# Altium project Convertor.PrjPCB
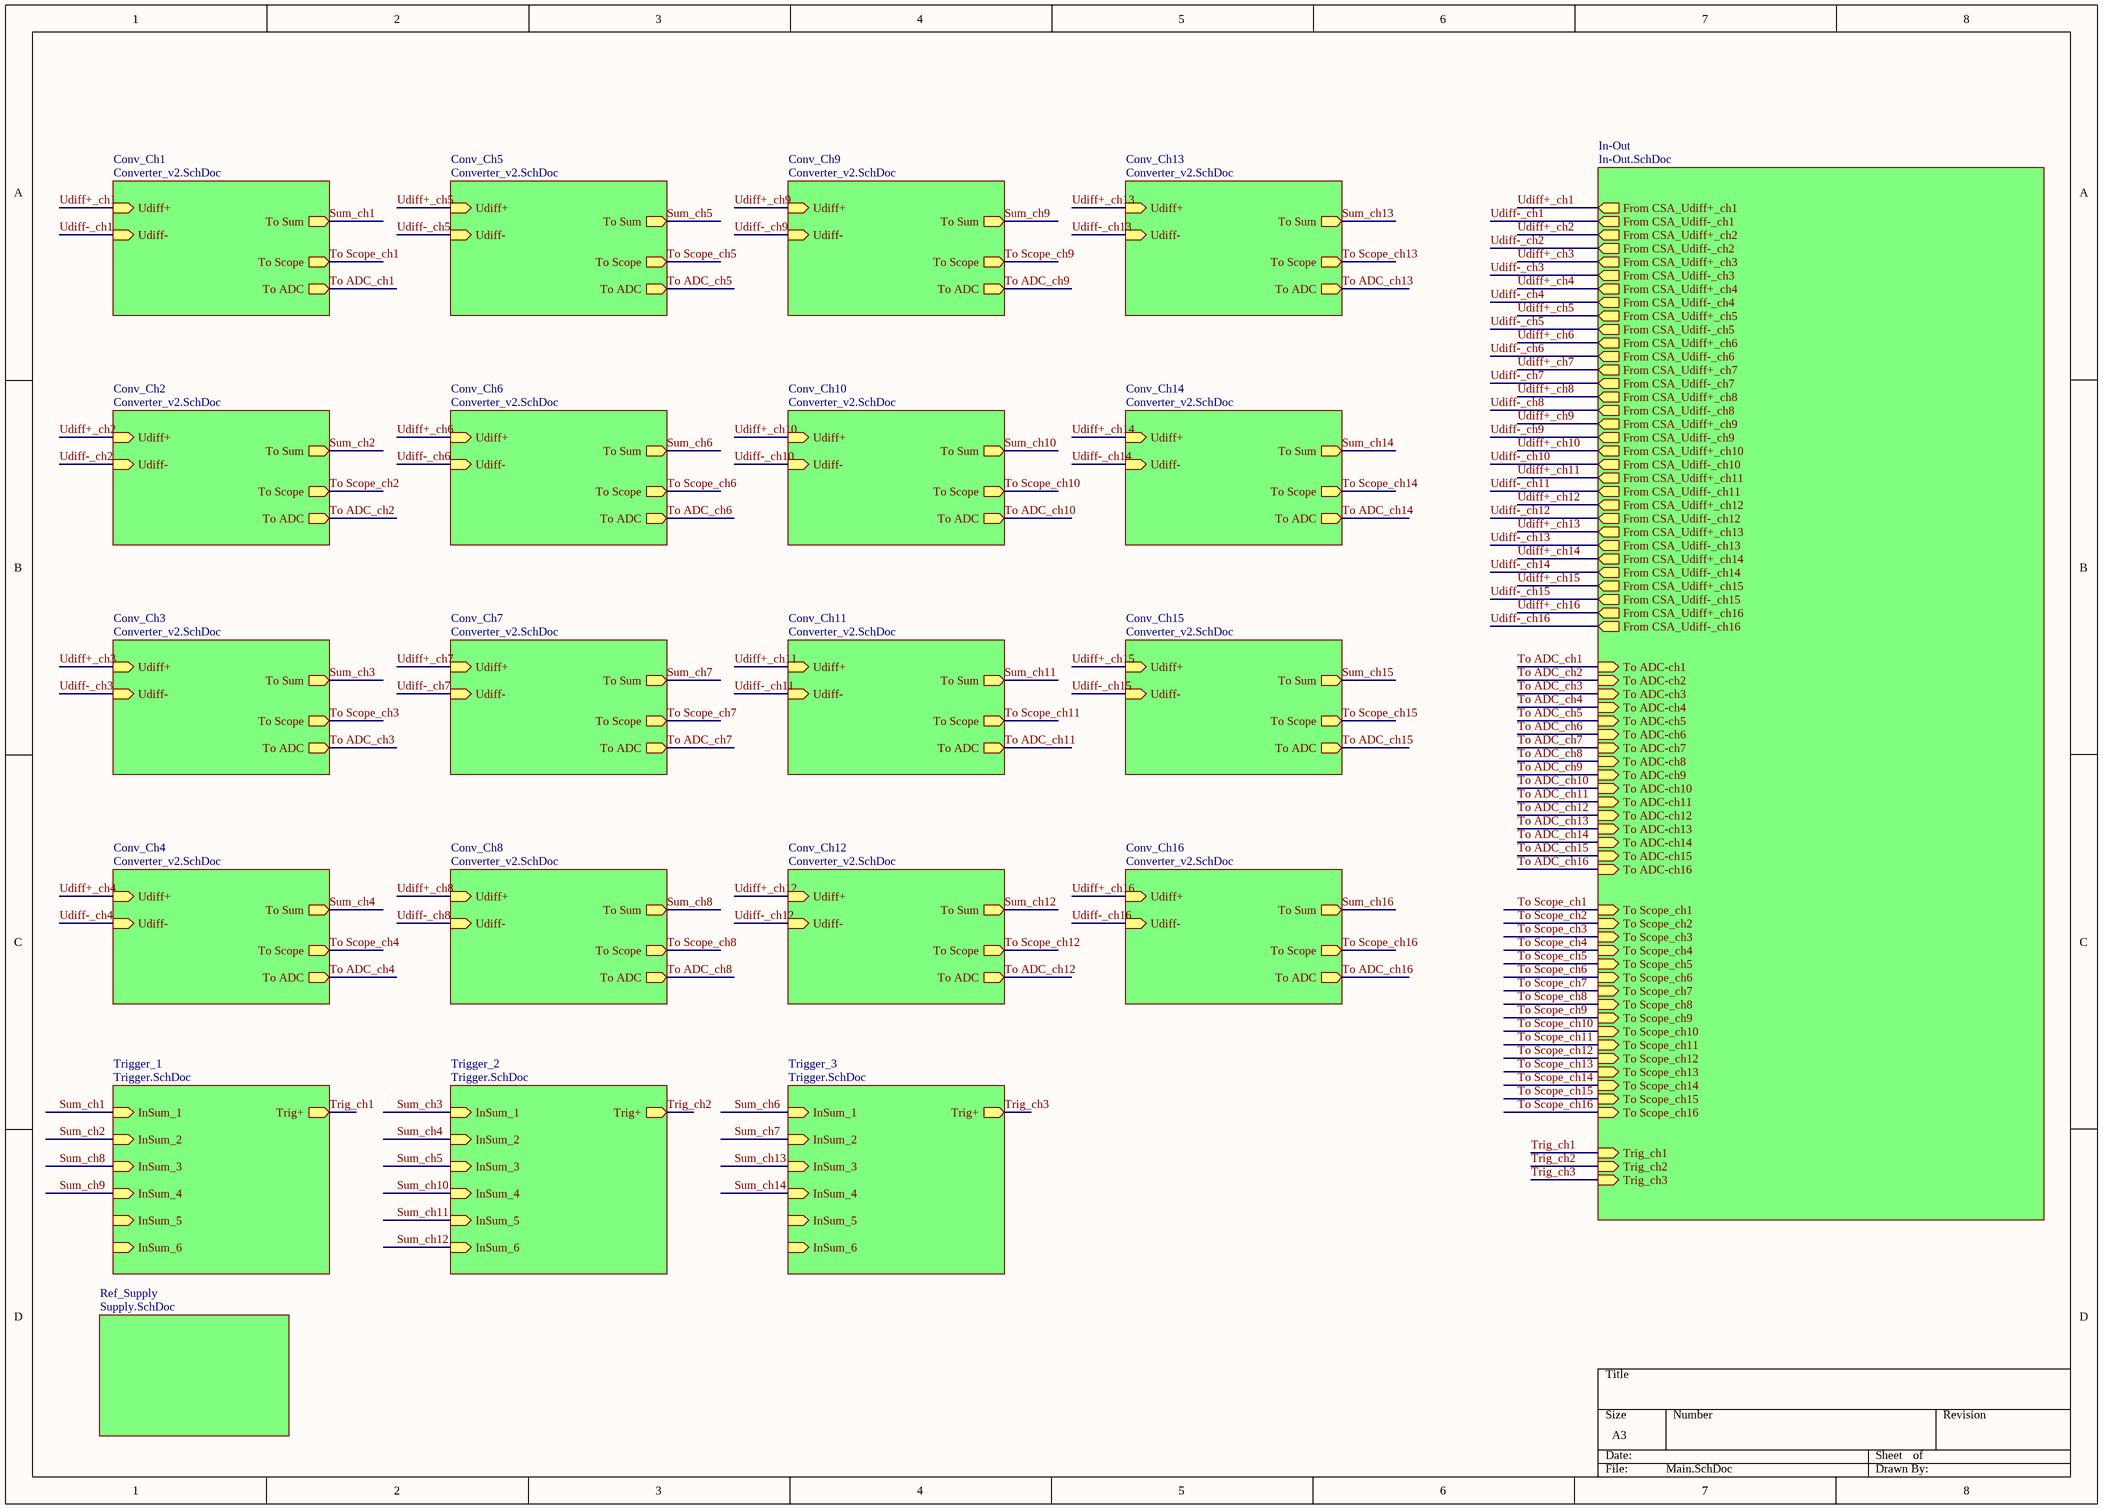
[diagram p0: Main.SchDoc]
4 sheets, 55 parts. Net scope: hierarchical (ports join the sheet entries above them; power ports are global).
Sheets:
  Main.SchDoc
    In-Out = In-Out.SchDoc
    Ref_Supply = Supply.SchDoc
    Trigger_1 = Trigger.SchDoc
    Trigger_2 = Trigger.SchDoc
    Trigger_3 = Trigger.SchDoc

## Sheet Main.SchDoc
size A3; PageSetup: Record=PageOptions|CenterHorizontal=True|CenterVertical=True|PrintScale=0.73|XCorrection=1.00|YCorrection=1.00|PrintKind=0|BorderSize=5000000|LeftOffset=0|BottomOffset=0|Orientation=2|PaperLength=1000|PaperWidth=1000|Scale=100|PaperSource=7|PrintQuality=600|MediaType=1|DitherType=10|PaperKind=A4|PrintScaleMode=1

### Sub-sheets
Conv_Ch1 = Converter_v2.SchDoc (file not in this document): Udiff+ (in), Udiff- (in), To ADC (out), To Sum (out), To Scope (out)
Conv_Ch2 = Converter_v2.SchDoc (file not in this document): Udiff+ (in), Udiff- (in), To ADC (out), To Sum (out), To Scope (out)
Conv_Ch3 = Converter_v2.SchDoc (file not in this document): Udiff+ (in), Udiff- (in), To ADC (out), To Sum (out), To Scope (out)
Conv_Ch4 = Converter_v2.SchDoc (file not in this document): Udiff+ (in), Udiff- (in), To ADC (out), To Sum (out), To Scope (out)
Conv_Ch5 = Converter_v2.SchDoc (file not in this document): Udiff+ (in), Udiff- (in), To ADC (out), To Sum (out), To Scope (out)
Conv_Ch6 = Converter_v2.SchDoc (file not in this document): Udiff+ (in), Udiff- (in), To ADC (out), To Sum (out), To Scope (out)
Conv_Ch7 = Converter_v2.SchDoc (file not in this document): Udiff+ (in), Udiff- (in), To ADC (out), To Sum (out), To Scope (out)
Conv_Ch8 = Converter_v2.SchDoc (file not in this document): Udiff+ (in), Udiff- (in), To ADC (out), To Sum (out), To Scope (out)
Conv_Ch9 = Converter_v2.SchDoc (file not in this document): Udiff+ (in), Udiff- (in), To ADC (out), To Sum (out), To Scope (out)
Conv_Ch10 = Converter_v2.SchDoc (file not in this document): Udiff+ (in), Udiff- (in), To ADC (out), To Sum (out), To Scope (out)
Conv_Ch11 = Converter_v2.SchDoc (file not in this document): Udiff+ (in), Udiff- (in), To ADC (out), To Sum (out), To Scope (out)
Conv_Ch12 = Converter_v2.SchDoc (file not in this document): Udiff+ (in), Udiff- (in), To ADC (out), To Sum (out), To Scope (out)
Conv_Ch13 = Converter_v2.SchDoc (file not in this document): Udiff+ (in), Udiff- (in), To ADC (out), To Sum (out), To Scope (out)
Conv_Ch14 = Converter_v2.SchDoc (file not in this document): Udiff+ (in), Udiff- (in), To ADC (out), To Sum (out), To Scope (out)
Conv_Ch15 = Converter_v2.SchDoc (file not in this document): Udiff+ (in), Udiff- (in), To ADC (out), To Sum (out), To Scope (out)
Conv_Ch16 = Converter_v2.SchDoc (file not in this document): Udiff+ (in), Udiff- (in), To ADC (out), To Sum (out), To Scope (out)
In-Out = In-Out.SchDoc: To ADC-ch1 (in), To ADC-ch2 (in), To ADC-ch3 (in), To ADC-ch4 (in), To ADC-ch5 (in), To ADC-ch6 (in), To ADC-ch7 (in), To ADC-ch8 (in), To ADC-ch9 (in), To ADC-ch10 (in), To ADC-ch11 (in), To ADC-ch12 (in), To ADC-ch13 (in), To ADC-ch14 (in), From CSA_Udiff+_ch1 (out), From CSA_Udiff+_ch2 (out), From CSA_Udiff+_ch3 (out), From CSA_Udiff+_ch4 (out), From CSA_Udiff+_ch5 (out), From CSA_Udiff+_ch6 (out), From CSA_Udiff+_ch7 (out), From CSA_Udiff+_ch8 (out), From CSA_Udiff+_ch9 (out), From CSA_Udiff+_ch10 (out), From CSA_Udiff+_ch11 (out), From CSA_Udiff+_ch12 (out), From CSA_Udiff+_ch13 (out), From CSA_Udiff+_ch14 (out), From CSA_Udiff-_ch1 (out), From CSA_Udiff-_ch2 (out), From CSA_Udiff-_ch3 (out), From CSA_Udiff-_ch4 (out), From CSA_Udiff-_ch5 (out), From CSA_Udiff-_ch6 (out), From CSA_Udiff-_ch7 (out), From CSA_Udiff-_ch8 (out), From CSA_Udiff-_ch9 (out), From CSA_Udiff-_ch10 (out), From CSA_Udiff-_ch11 (out), From CSA_Udiff-_ch12 (out), From CSA_Udiff-_ch13 (out), From CSA_Udiff-_ch14 (out), To ADC-ch15 (in), To ADC-ch16 (in), From CSA_Udiff+_ch15 (out), From CSA_Udiff+_ch16 (out), From CSA_Udiff-_ch15 (out), From CSA_Udiff-_ch16 (out), Trig_ch1 (in), Trig_ch2 (in), Trig_ch3 (in), To Scope_ch1 (in), To Scope_ch2 (in), To Scope_ch3 (in), To Scope_ch4 (in), To Scope_ch5 (in), To Scope_ch6 (in), To Scope_ch7 (in), To Scope_ch8 (in), To Scope_ch9 (in), To Scope_ch10 (in), To Scope_ch11 (in), To Scope_ch12 (in), To Scope_ch13 (in), To Scope_ch14 (in), To Scope_ch15 (in), To Scope_ch16 (in)
Ref_Supply = Supply.SchDoc: no entries
Trigger_1 = Trigger.SchDoc: InSum_1 (in), InSum_2 (in), InSum_3 (in), InSum_4 (in), Trig+ (out), InSum_5 (in), InSum_6 (in)
Trigger_2 = Trigger.SchDoc: InSum_1 (in), InSum_2 (in), InSum_3 (in), InSum_4 (in), Trig+ (out), InSum_5 (in), InSum_6 (in)
Trigger_3 = Trigger.SchDoc: InSum_1 (in), InSum_2 (in), InSum_3 (in), InSum_4 (in), Trig+ (out), InSum_5 (in), InSum_6 (in)

### Nets
Sum_ch1: sheet Conv_Ch1/To Sum, sheet Conv_Ch2/To Sum, sheet Conv_Ch8/To Sum, sheet Conv_Ch9/To Sum, sheet Trigger_1/InSum_1, sheet Trigger_1/InSum_2, sheet Trigger_1/InSum_3, sheet Trigger_1/InSum_4, sheet Trigger_1/InSum_5, sheet Trigger_1/InSum_6  [also labelled Sum_ch2, Sum_ch8, Sum_ch9]
Sum_ch10: sheet Conv_Ch3/To Sum, sheet Conv_Ch4/To Sum, sheet Conv_Ch5/To Sum, sheet Conv_Ch10/To Sum, sheet Conv_Ch11/To Sum, sheet Conv_Ch12/To Sum, sheet Trigger_2/InSum_1, sheet Trigger_2/InSum_2, sheet Trigger_2/InSum_3, sheet Trigger_2/InSum_4, sheet Trigger_2/InSum_5, sheet Trigger_2/InSum_6  [also labelled Sum_ch11, Sum_ch12, Sum_ch3, Sum_ch4, Sum_ch5]
Sum_ch13: sheet Conv_Ch6/To Sum, sheet Conv_Ch7/To Sum, sheet Conv_Ch13/To Sum, sheet Conv_Ch14/To Sum, sheet Trigger_3/InSum_1, sheet Trigger_3/InSum_2, sheet Trigger_3/InSum_3, sheet Trigger_3/InSum_4, sheet Trigger_3/InSum_5, sheet Trigger_3/InSum_6  [also labelled Sum_ch14, Sum_ch6, Sum_ch7]
Sum_ch15: sheet Conv_Ch15/To Sum
Sum_ch16: sheet Conv_Ch16/To Sum
To ADC_ch1: sheet Conv_Ch1/To ADC, sheet In-Out/To ADC-ch1
To ADC_ch2: sheet Conv_Ch2/To ADC, sheet In-Out/To ADC-ch2
To ADC_ch3: sheet Conv_Ch3/To ADC, sheet In-Out/To ADC-ch3
To ADC_ch4: sheet Conv_Ch4/To ADC, sheet In-Out/To ADC-ch4
To ADC_ch5: sheet Conv_Ch5/To ADC, sheet In-Out/To ADC-ch5
To ADC_ch6: sheet Conv_Ch6/To ADC, sheet In-Out/To ADC-ch6
To ADC_ch7: sheet Conv_Ch7/To ADC, sheet In-Out/To ADC-ch7
To ADC_ch8: sheet Conv_Ch8/To ADC, sheet In-Out/To ADC-ch8
To ADC_ch9: sheet Conv_Ch9/To ADC, sheet In-Out/To ADC-ch9
To ADC_ch10: sheet Conv_Ch10/To ADC, sheet In-Out/To ADC-ch10
To ADC_ch11: sheet Conv_Ch11/To ADC, sheet In-Out/To ADC-ch11
To ADC_ch12: sheet Conv_Ch12/To ADC, sheet In-Out/To ADC-ch12
To ADC_ch13: sheet Conv_Ch13/To ADC, sheet In-Out/To ADC-ch13
To ADC_ch14: sheet Conv_Ch14/To ADC, sheet In-Out/To ADC-ch14
To ADC_ch15: sheet Conv_Ch15/To ADC, sheet In-Out/To ADC-ch15
To ADC_ch16: sheet Conv_Ch16/To ADC, sheet In-Out/To ADC-ch16
To Scope_ch1: sheet Conv_Ch1/To Scope, sheet In-Out/To Scope_ch1
To Scope_ch2: sheet Conv_Ch2/To Scope, sheet In-Out/To Scope_ch2
To Scope_ch3: sheet Conv_Ch3/To Scope, sheet In-Out/To Scope_ch3
To Scope_ch4: sheet Conv_Ch4/To Scope, sheet In-Out/To Scope_ch4
To Scope_ch5: sheet Conv_Ch5/To Scope, sheet In-Out/To Scope_ch5
To Scope_ch6: sheet Conv_Ch6/To Scope, sheet In-Out/To Scope_ch6
To Scope_ch7: sheet Conv_Ch7/To Scope, sheet In-Out/To Scope_ch7
To Scope_ch8: sheet Conv_Ch8/To Scope, sheet In-Out/To Scope_ch8
To Scope_ch9: sheet Conv_Ch9/To Scope, sheet In-Out/To Scope_ch9
To Scope_ch10: sheet Conv_Ch10/To Scope, sheet In-Out/To Scope_ch10
To Scope_ch11: sheet Conv_Ch11/To Scope, sheet In-Out/To Scope_ch11
To Scope_ch12: sheet Conv_Ch12/To Scope, sheet In-Out/To Scope_ch12
To Scope_ch13: sheet Conv_Ch13/To Scope, sheet In-Out/To Scope_ch13
To Scope_ch14: sheet Conv_Ch14/To Scope, sheet In-Out/To Scope_ch14
To Scope_ch15: sheet Conv_Ch15/To Scope, sheet In-Out/To Scope_ch15
To Scope_ch16: sheet Conv_Ch16/To Scope, sheet In-Out/To Scope_ch16
Trig_ch1: sheet In-Out/Trig_ch1, sheet Trigger_1/Trig+
Trig_ch2: sheet In-Out/Trig_ch2, sheet Trigger_2/Trig+
Trig_ch3: sheet In-Out/Trig_ch3, sheet Trigger_3/Trig+
Udiff+_ch1: sheet Conv_Ch1/Udiff+, sheet In-Out/From CSA_Udiff+_ch1
Udiff+_ch2: sheet Conv_Ch2/Udiff+, sheet In-Out/From CSA_Udiff+_ch2
Udiff+_ch3: sheet Conv_Ch3/Udiff+, sheet In-Out/From CSA_Udiff+_ch3
Udiff+_ch4: sheet Conv_Ch4/Udiff+, sheet In-Out/From CSA_Udiff+_ch4
Udiff+_ch5: sheet Conv_Ch5/Udiff+, sheet In-Out/From CSA_Udiff+_ch5
Udiff+_ch6: sheet Conv_Ch6/Udiff+, sheet In-Out/From CSA_Udiff+_ch6
Udiff+_ch7: sheet Conv_Ch7/Udiff+, sheet In-Out/From CSA_Udiff+_ch7
Udiff+_ch8: sheet Conv_Ch8/Udiff+, sheet In-Out/From CSA_Udiff+_ch8
Udiff+_ch9: sheet Conv_Ch9/Udiff+, sheet In-Out/From CSA_Udiff+_ch9
Udiff+_ch10: sheet Conv_Ch10/Udiff+, sheet In-Out/From CSA_Udiff+_ch10
Udiff+_ch11: sheet Conv_Ch11/Udiff+, sheet In-Out/From CSA_Udiff+_ch11
Udiff+_ch12: sheet Conv_Ch12/Udiff+, sheet In-Out/From CSA_Udiff+_ch12
Udiff+_ch13: sheet Conv_Ch13/Udiff+, sheet In-Out/From CSA_Udiff+_ch13
Udiff+_ch14: sheet Conv_Ch14/Udiff+, sheet In-Out/From CSA_Udiff+_ch14
Udiff+_ch15: sheet Conv_Ch15/Udiff+, sheet In-Out/From CSA_Udiff+_ch15
Udiff+_ch16: sheet Conv_Ch16/Udiff+, sheet In-Out/From CSA_Udiff+_ch16
Udiff-_ch1: sheet Conv_Ch1/Udiff-, sheet In-Out/From CSA_Udiff-_ch1
Udiff-_ch2: sheet Conv_Ch2/Udiff-, sheet In-Out/From CSA_Udiff-_ch2
Udiff-_ch3: sheet Conv_Ch3/Udiff-, sheet In-Out/From CSA_Udiff-_ch3
Udiff-_ch4: sheet Conv_Ch4/Udiff-, sheet In-Out/From CSA_Udiff-_ch4
Udiff-_ch5: sheet Conv_Ch5/Udiff-, sheet In-Out/From CSA_Udiff-_ch5
Udiff-_ch6: sheet Conv_Ch6/Udiff-, sheet In-Out/From CSA_Udiff-_ch6
Udiff-_ch7: sheet Conv_Ch7/Udiff-, sheet In-Out/From CSA_Udiff-_ch7
Udiff-_ch8: sheet Conv_Ch8/Udiff-, sheet In-Out/From CSA_Udiff-_ch8
Udiff-_ch9: sheet Conv_Ch9/Udiff-, sheet In-Out/From CSA_Udiff-_ch9
Udiff-_ch10: sheet Conv_Ch10/Udiff-, sheet In-Out/From CSA_Udiff-_ch10
Udiff-_ch11: sheet Conv_Ch11/Udiff-, sheet In-Out/From CSA_Udiff-_ch11
Udiff-_ch12: sheet Conv_Ch12/Udiff-, sheet In-Out/From CSA_Udiff-_ch12
Udiff-_ch13: sheet Conv_Ch13/Udiff-, sheet In-Out/From CSA_Udiff-_ch13
Udiff-_ch14: sheet Conv_Ch14/Udiff-, sheet In-Out/From CSA_Udiff-_ch14
Udiff-_ch15: sheet Conv_Ch15/Udiff-, sheet In-Out/From CSA_Udiff-_ch15
Udiff-_ch16: sheet Conv_Ch16/Udiff-, sheet In-Out/From CSA_Udiff-_ch16

## Sheet In-Out.SchDoc
size A4; PageSetup: Record=PageOptions|CenterHorizontal=True|CenterVertical=True|PrintScale=1.00|XCorrection=1.00|YCorrection=1.00|PrintKind=0|BorderSize=5000000|LeftOffset=0|BottomOffset=0|Orientation=2|PaperLength=1000|PaperWidth=1000|Scale=100|PaperSource=7|PrintQuality=-4|MediaType=1|DitherType=10|PaperKind=A4|PrintScaleMode=1
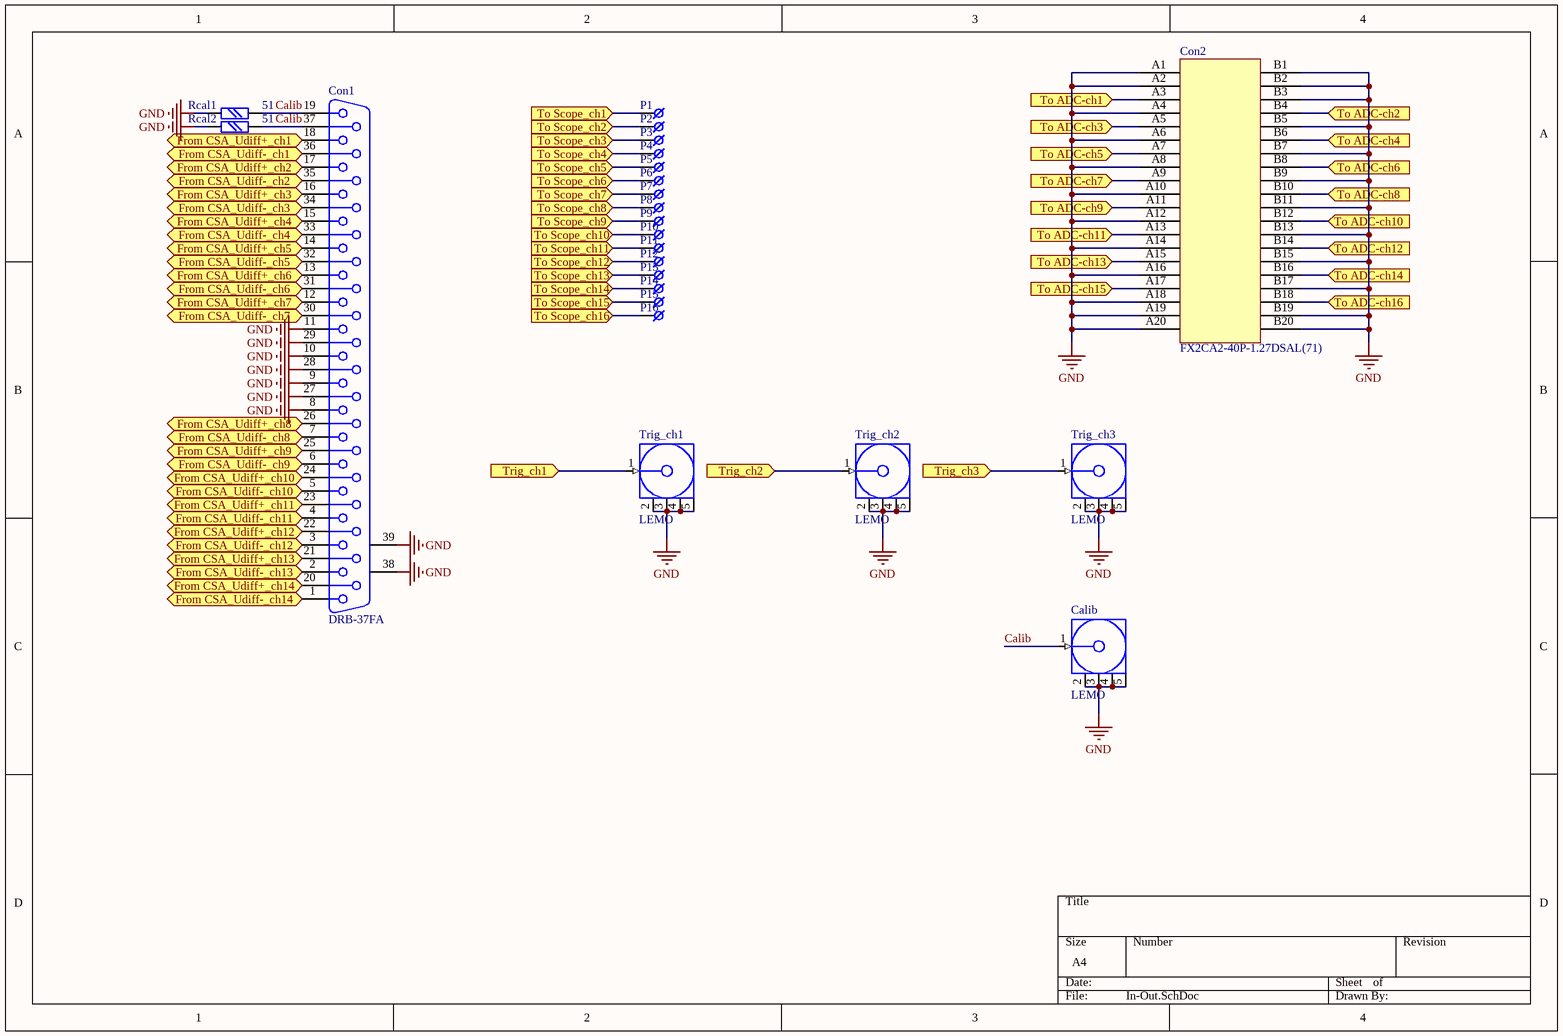
[diagram p1: In-Out.SchDoc]

### Parts
Calib  LEMO  [LEMO]
Con1  DRB-37FA  [DBR-F-37]
Con2  FX2CA2-40P-1.27DSAL(71)
P1  KLEMME  [Pad12]  (value not drawn)
P2  KLEMME  [Pad12]  (value not drawn)
P3  KLEMME  [Pad12]  (value not drawn)
P4  KLEMME  [Pad12]  (value not drawn)
P5  KLEMME  [Pad12]  (value not drawn)
P6  KLEMME  [Pad12]  (value not drawn)
P7  KLEMME  [Pad12]  (value not drawn)
P8  KLEMME  [Pad12]  (value not drawn)
P9  KLEMME  [Pad12]  (value not drawn)
P10  KLEMME  [Pad12]  (value not drawn)
P11  KLEMME  [Pad12]  (value not drawn)
P12  KLEMME  [Pad12]  (value not drawn)
P13  KLEMME  [Pad12]  (value not drawn)
P14  KLEMME  [Pad12]  (value not drawn)
P15  KLEMME  [Pad12]  (value not drawn)
P16  KLEMME  [Pad12]  (value not drawn)
Rcal1  51  [chip0603]
Rcal2  51  [chip0603]
Trig_ch1  LEMO  [LEMO]
Trig_ch2  LEMO  [LEMO]
Trig_ch3  LEMO  [LEMO]

### Ports
From CSA_Udiff+_ch1 (in), From CSA_Udiff+_ch2 (in), From CSA_Udiff+_ch3 (in), From CSA_Udiff+_ch4 (in), From CSA_Udiff+_ch5 (in), From CSA_Udiff+_ch6 (in), From CSA_Udiff+_ch7 (in), From CSA_Udiff+_ch8 (in), From CSA_Udiff+_ch9 (in), From CSA_Udiff+_ch10 (in), From CSA_Udiff+_ch11 (in), From CSA_Udiff+_ch12 (in), From CSA_Udiff+_ch13 (in), From CSA_Udiff+_ch14 (in), From CSA_Udiff-_ch1 (in), From CSA_Udiff-_ch2 (in), From CSA_Udiff-_ch3 (in), From CSA_Udiff-_ch4 (in), From CSA_Udiff-_ch5 (in), From CSA_Udiff-_ch6 (in), From CSA_Udiff-_ch7 (in), From CSA_Udiff-_ch8 (in), From CSA_Udiff-_ch9 (in), From CSA_Udiff-_ch10 (in), From CSA_Udiff-_ch11 (in), From CSA_Udiff-_ch12 (in), From CSA_Udiff-_ch13 (in), From CSA_Udiff-_ch14 (in), To ADC-ch1 (in), To ADC-ch2 (in), To ADC-ch3 (in), To ADC-ch4 (in), To ADC-ch5 (in), To ADC-ch6 (in), To ADC-ch7 (in), To ADC-ch8 (in), To ADC-ch9 (in), To ADC-ch10 (in), To ADC-ch11 (in), To ADC-ch12 (in), To ADC-ch13 (in), To ADC-ch14 (in), To ADC-ch15 (in), To ADC-ch16 (in), To Scope_ch1 (in), To Scope_ch2 (in), To Scope_ch3 (in), To Scope_ch4 (in), To Scope_ch5 (in), To Scope_ch6 (in), To Scope_ch7 (in), To Scope_ch8 (in), To Scope_ch9 (in), To Scope_ch10 (in), To Scope_ch11 (in), To Scope_ch12 (in), To Scope_ch13 (in), To Scope_ch14 (in), To Scope_ch15 (in), To Scope_ch16 (in), Trig_ch1 (in), Trig_ch2 (in), Trig_ch3 (in)

### Nets
GND: Calib.2(GND) Calib.3(GND) Calib.4(GND) Calib.5(GND) Con1.8 Con1.9 Con1.10 Con1.11 Con1.27 Con1.28 Con1.29 Con1.38 Con1.39 Con2.A1 Con2.A2 Con2.A4 Con2.A6 Con2.A8 Con2.A10 Con2.A12 Con2.A14 Con2.A16 Con2.A18 Con2.A19 Con2.A20 Con2.B1 Con2.B2 Con2.B3 Con2.B5 Con2.B7 Con2.B9 Con2.B11 Con2.B13 Con2.B15 Con2.B17 Con2.B19 Con2.B20 Rcal1.2 Rcal2.2 Trig_ch1.2(GND) Trig_ch1.3(GND) Trig_ch1.4(GND) Trig_ch1.5(GND) Trig_ch2.2(GND) Trig_ch2.3(GND) Trig_ch2.4(GND) Trig_ch2.5(GND) Trig_ch3.2(GND) Trig_ch3.3(GND) Trig_ch3.4(GND) Trig_ch3.5(GND)
Calib: Calib.1(Signal) Con1.19 Con1.37 Rcal1.1 Rcal2.1
To ADC_ch1: Con2.A3 ; port To ADC-ch1
To ADC_ch2: Con2.B4 ; port To ADC-ch2
To ADC_ch3: Con2.A5 ; port To ADC-ch3
To ADC_ch4: Con2.B6 ; port To ADC-ch4
To ADC_ch5: Con2.A7 ; port To ADC-ch5
To ADC_ch6: Con2.B8 ; port To ADC-ch6
To ADC_ch7: Con2.A9 ; port To ADC-ch7
To ADC_ch8: Con2.B10 ; port To ADC-ch8
To ADC_ch9: Con2.A11 ; port To ADC-ch9
To ADC_ch10: Con2.B12 ; port To ADC-ch10
To ADC_ch11: Con2.A13 ; port To ADC-ch11
To ADC_ch12: Con2.B14 ; port To ADC-ch12
To ADC_ch13: Con2.A15 ; port To ADC-ch13
To ADC_ch14: Con2.B16 ; port To ADC-ch14
To ADC_ch15: Con2.A17 ; port To ADC-ch15
To ADC_ch16: Con2.B18 ; port To ADC-ch16
To Scope_ch1: P1.PAD ; port To Scope_ch1
To Scope_ch2: P2.PAD ; port To Scope_ch2
To Scope_ch3: P3.PAD ; port To Scope_ch3
To Scope_ch4: P4.PAD ; port To Scope_ch4
To Scope_ch5: P5.PAD ; port To Scope_ch5
To Scope_ch6: P6.PAD ; port To Scope_ch6
To Scope_ch7: P7.PAD ; port To Scope_ch7
To Scope_ch8: P8.PAD ; port To Scope_ch8
To Scope_ch9: P9.PAD ; port To Scope_ch9
To Scope_ch10: P10.PAD ; port To Scope_ch10
To Scope_ch11: P11.PAD ; port To Scope_ch11
To Scope_ch12: P12.PAD ; port To Scope_ch12
To Scope_ch13: P13.PAD ; port To Scope_ch13
To Scope_ch14: P14.PAD ; port To Scope_ch14
To Scope_ch15: P15.PAD ; port To Scope_ch15
To Scope_ch16: P16.PAD ; port To Scope_ch16
Trig_ch1: Trig_ch1.1(Signal) ; port Trig_ch1
Trig_ch2: Trig_ch2.1(Signal) ; port Trig_ch2
Trig_ch3: Trig_ch3.1(Signal) ; port Trig_ch3
Udiff+_ch1: Con1.18 ; port From CSA_Udiff+_ch1
Udiff+_ch2: Con1.17 ; port From CSA_Udiff+_ch2
Udiff+_ch3: Con1.16 ; port From CSA_Udiff+_ch3
Udiff+_ch4: Con1.15 ; port From CSA_Udiff+_ch4
Udiff+_ch5: Con1.14 ; port From CSA_Udiff+_ch5
Udiff+_ch6: Con1.13 ; port From CSA_Udiff+_ch6
Udiff+_ch7: Con1.12 ; port From CSA_Udiff+_ch7
Udiff+_ch8: Con1.26 ; port From CSA_Udiff+_ch8
Udiff+_ch9: Con1.25 ; port From CSA_Udiff+_ch9
Udiff+_ch10: Con1.24 ; port From CSA_Udiff+_ch10
Udiff+_ch11: Con1.23 ; port From CSA_Udiff+_ch11
Udiff+_ch12: Con1.22 ; port From CSA_Udiff+_ch12
Udiff+_ch13: Con1.21 ; port From CSA_Udiff+_ch13
Udiff+_ch14: Con1.20 ; port From CSA_Udiff+_ch14
Udiff-_ch1: Con1.36 ; port From CSA_Udiff-_ch1
Udiff-_ch2: Con1.35 ; port From CSA_Udiff-_ch2
Udiff-_ch3: Con1.34 ; port From CSA_Udiff-_ch3
Udiff-_ch4: Con1.33 ; port From CSA_Udiff-_ch4
Udiff-_ch5: Con1.32 ; port From CSA_Udiff-_ch5
Udiff-_ch6: Con1.31 ; port From CSA_Udiff-_ch6
Udiff-_ch7: Con1.30 ; port From CSA_Udiff-_ch7
Udiff-_ch8: Con1.7 ; port From CSA_Udiff-_ch8
Udiff-_ch9: Con1.6 ; port From CSA_Udiff-_ch9
Udiff-_ch10: Con1.5 ; port From CSA_Udiff-_ch10
Udiff-_ch11: Con1.4 ; port From CSA_Udiff-_ch11
Udiff-_ch12: Con1.3 ; port From CSA_Udiff-_ch12
Udiff-_ch13: Con1.2 ; port From CSA_Udiff-_ch13
Udiff-_ch14: Con1.1 ; port From CSA_Udiff-_ch14

### Library data of the parts
Calib Trig_ch1-Trig_ch3 = COAX-F: RF Coaxial PCB Connector, MCX; Thru-Hole, Right-Angle Mount Socket, Blunt Post Terminal, 50 Ohm Impedance; PCB_Layout: Complies with manufacturer's recommendation.; DrillSize: Corresponds to nominal value.; Published: 15-Jul-2004; LatestRevisionDate: 15-Jul-2004; LatestRevisionNote: Component Replaced.; DatasheetDocument: 30-May-2003; PackageDocument: 04-Jul-1999; PackageReference: 919-119J-51AX; Publisher: Altium Limited; ComponentLink1Description: Manufacturer Link; ComponentLink1URL: http://www.amphenolrf.com/
Con1 = DBR-37F
P1-P16 = KLEMME: Text Field1: 10; Text Field2: 20
Rcal1 Rcal2 = R: Text Field1: 20; Text Field2: 20

## Sheet Supply.SchDoc
size A4; PageSetup: Record=PageOptions|CenterHorizontal=True|CenterVertical=True|PrintScale=1.00|XCorrection=1.00|YCorrection=1.00|PrintKind=0|BorderSize=5000000|LeftOffset=0|BottomOffset=0|Orientation=2|PaperLength=1000|PaperWidth=1000|Scale=100|PaperSource=7|PrintQuality=-4|MediaType=1|DitherType=10|PaperKind=A4|PrintScaleMode=1
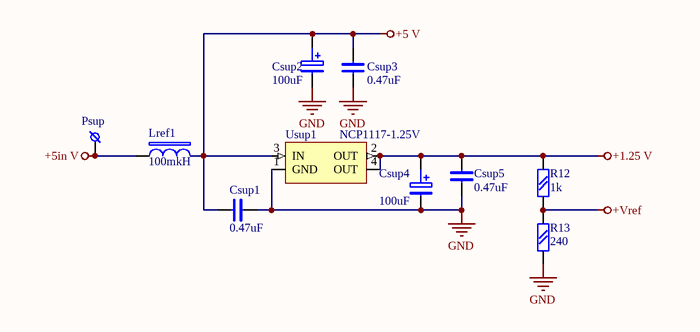
[diagram p2: Supply.SchDoc]

### Parts
Csup1  0.47uF  [chip0805]
Csup2  100uF  [CEL-SMD300]
Csup3  0.47uF  [chip0805]
Csup4  100uF  [CEL-SMD300]
Csup5  0.47uF  [chip0805]
Lref1  100mkH  [SDR0604]
Psup  KLEMME  [Pad12]  (value not drawn)
R12  1k  [chip0805]
R13  240  [chip0805]
Usup1  NCP1117-1.25V  [TO-252]

### Nets
+1.25 V: Csup4.+ Csup5.1 R12.2 Usup1.2(OUT) Usup1.4(OUT)
+5 V: Csup1.1 Csup2.+ Csup3.1 Lref1.2 Usup1.3(IN)
+5in V: Lref1.1 Psup.PAD
+Vref: R12.1 R13.1
GND: Csup1.2 Csup2.- Csup3.2 Csup4.- Csup5.2 R13.2 Usup1.1(GND)

### Library data of the parts
Csup1 Csup3 Csup5 = C: Text Field1: 20; Text Field2: 10
Csup2 Csup4 = C POL: Text Field1: 20; Text Field2: 20
Lref1 = DR: Text Field1: 30; Text Field2: 10
Psup = KLEMME: Text Field1: 10; Text Field2: 20
R12 R13 = R: Text Field1: 20; Text Field2: 20
Usup1 = NCP1117-3.3V

## Sheet Trigger.SchDoc
size A4; PageSetup: Record=PageOptions|CenterHorizontal=True|CenterVertical=True|PrintScale=1.00|XCorrection=1.00|YCorrection=1.00|PrintKind=0|BorderSize=5000000|LeftOffset=0|BottomOffset=0|Orientation=2|PaperLength=1000|PaperWidth=1000|Scale=100|PaperSource=7|PrintQuality=-4|MediaType=1|DitherType=10|PaperKind=A4|PrintScaleMode=1
Used 3 times, as channels Trigger_1, Trigger_2, Trigger_3. Parts and nets are listed once, with the designators drawn on the sheet.
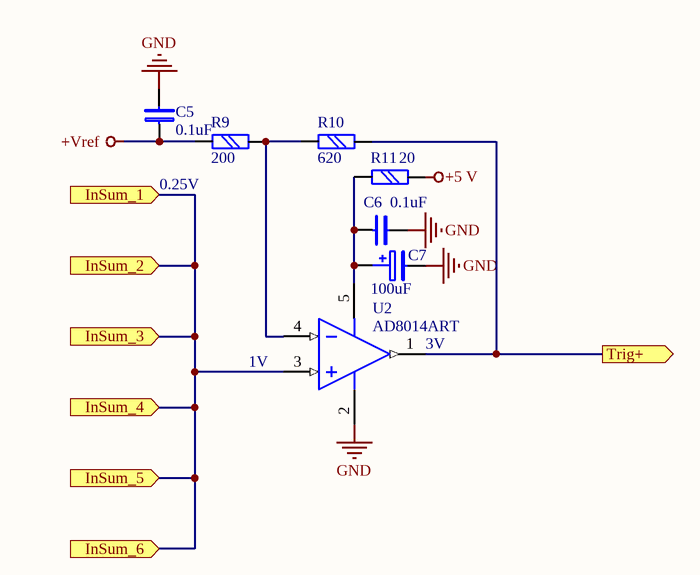
[diagram p3: Trigger.SchDoc]

### Parts
C5  0.1uF  [chip0603]
C6  0.1uF  [chip0603]
C7  100uF  [CEL-SMD300]
R9  200  [chip0603]
R10  620  [chip0603]
R11  20  [chip0603]
U2  AD8014ART  [RT-5]

### Ports
InSum_1 (in), InSum_2 (in), InSum_3 (in), InSum_4 (in), InSum_5 (in), InSum_6 (in), Trig+ (out)

### Nets
+5 V: R11.1
+Vref : C5.2 R9.2
GND: C5.1 C6.1 C7.- U2.2(V-)
InSum_1: U2.3(IN+) ; port InSum_1, port InSum_2, port InSum_3, port InSum_4, port InSum_5, port InSum_6
Trig+: R10.2 U2.1(OUT) ; port Trig+
NetC6_2: C6.2 C7.+ R11.2 U2.5(V+)
NetR9_1: R9.1 R10.1 U2.4(IN-)

### Channels
Trigger_1: designators end in _Trigger_1; ports InSum_1=Sum_ch1 InSum_2=Sum_ch1 InSum_3=Sum_ch1 InSum_4=Sum_ch1 InSum_5=Sum_ch1 InSum_6=Sum_ch1 Trig+=Trig_ch1
Trigger_2: designators end in _Trigger_2; ports InSum_1=Sum_ch10 InSum_2=Sum_ch10 InSum_3=Sum_ch10 InSum_4=Sum_ch10 InSum_5=Sum_ch10 InSum_6=Sum_ch10 Trig+=Trig_ch2
Trigger_3: designators end in _Trigger_3; ports InSum_1=Sum_ch13 InSum_2=Sum_ch13 InSum_3=Sum_ch13 InSum_4=Sum_ch13 InSum_5=Sum_ch13 InSum_6=Sum_ch13 Trig+=Trig_ch3

### Notes on the sheet
- 0.25V
- (near U2) 1V
- (near U2) 3V

### Library data of the parts
C5 C6 = C: Text Field1: 20; Text Field2: 10
C7 = C POL: Text Field1: 20; Text Field2: 20
R9 R10 = R: Text Field1: 20; Text Field2: 20
R11 = R: Text Field1: 20; Text Field2: 20
U2 = AD8055ART: Low Cost, 300MHz Voltage Feedback Amplifier; Published: 8-Jun-2000; LatestRevisionDate: 17-Jul-2002; LatestRevisionNote: Re-released for DXP Platform.; DatasheetVersion: REV. 0 1997; PackageReference: RT-5; Publisher: Altium Limited; PackageDescription: SOT-23/SC-74A; 5 Leads; Body 3.1 x 3 mm, inc. leads (LxW max); Code_JEDEC: MO-178AA; ComponentLink1Description: Manufacturer Link; ComponentLink1URL: http://www.analog.com/en/prod/0,,759_786_AD8055%2C00.html; ComponentLink2Description: Datasheet; ComponentLink2URL: http://www.analog.com/UploadedFiles/Data_Sheets/40402558757264AD8055_6_i.pdf

## Nets that join several sheets
+5 V: Supply (5 pins), Trigger_1 (R11_Trigger_1.1), Trigger_2 (R11_Trigger_2.1), Trigger_3 (R11_Trigger_3.1)
+Vref: Supply (R12.1 R13.1), Trigger_1 (C5_Trigger_1.2 R9_Trigger_1.2), Trigger_2 (C5_Trigger_2.2 R9_Trigger_2.2), Trigger_3 (C5_Trigger_3.2 R9_Trigger_3.2)
GND: In-Out (51 pins), Supply (7 pins), Trigger_1 (C5_Trigger_1.1 C6_Trigger_1.1 C7_Trigger_1.- U2_Trigger_1.2), Trigger_2 (C5_Trigger_2.1 C6_Trigger_2.1 C7_Trigger_2.- U2_Trigger_2.2), Trigger_3 (C5_Trigger_3.1 C6_Trigger_3.1 C7_Trigger_3.- U2_Trigger_3.2)
Trig_ch1: In-Out (Trig_ch1.1), Trigger_1 (R10_Trigger_1.2 U2_Trigger_1.1)
Trig_ch2: In-Out (Trig_ch2.1), Trigger_2 (R10_Trigger_2.2 U2_Trigger_2.1)
Trig_ch3: In-Out (Trig_ch3.1), Trigger_3 (R10_Trigger_3.2 U2_Trigger_3.1)